# Altium schematic sheet Sheet2.SchDoc
size A3; SheetNumber: 1; SheetTotal: 1
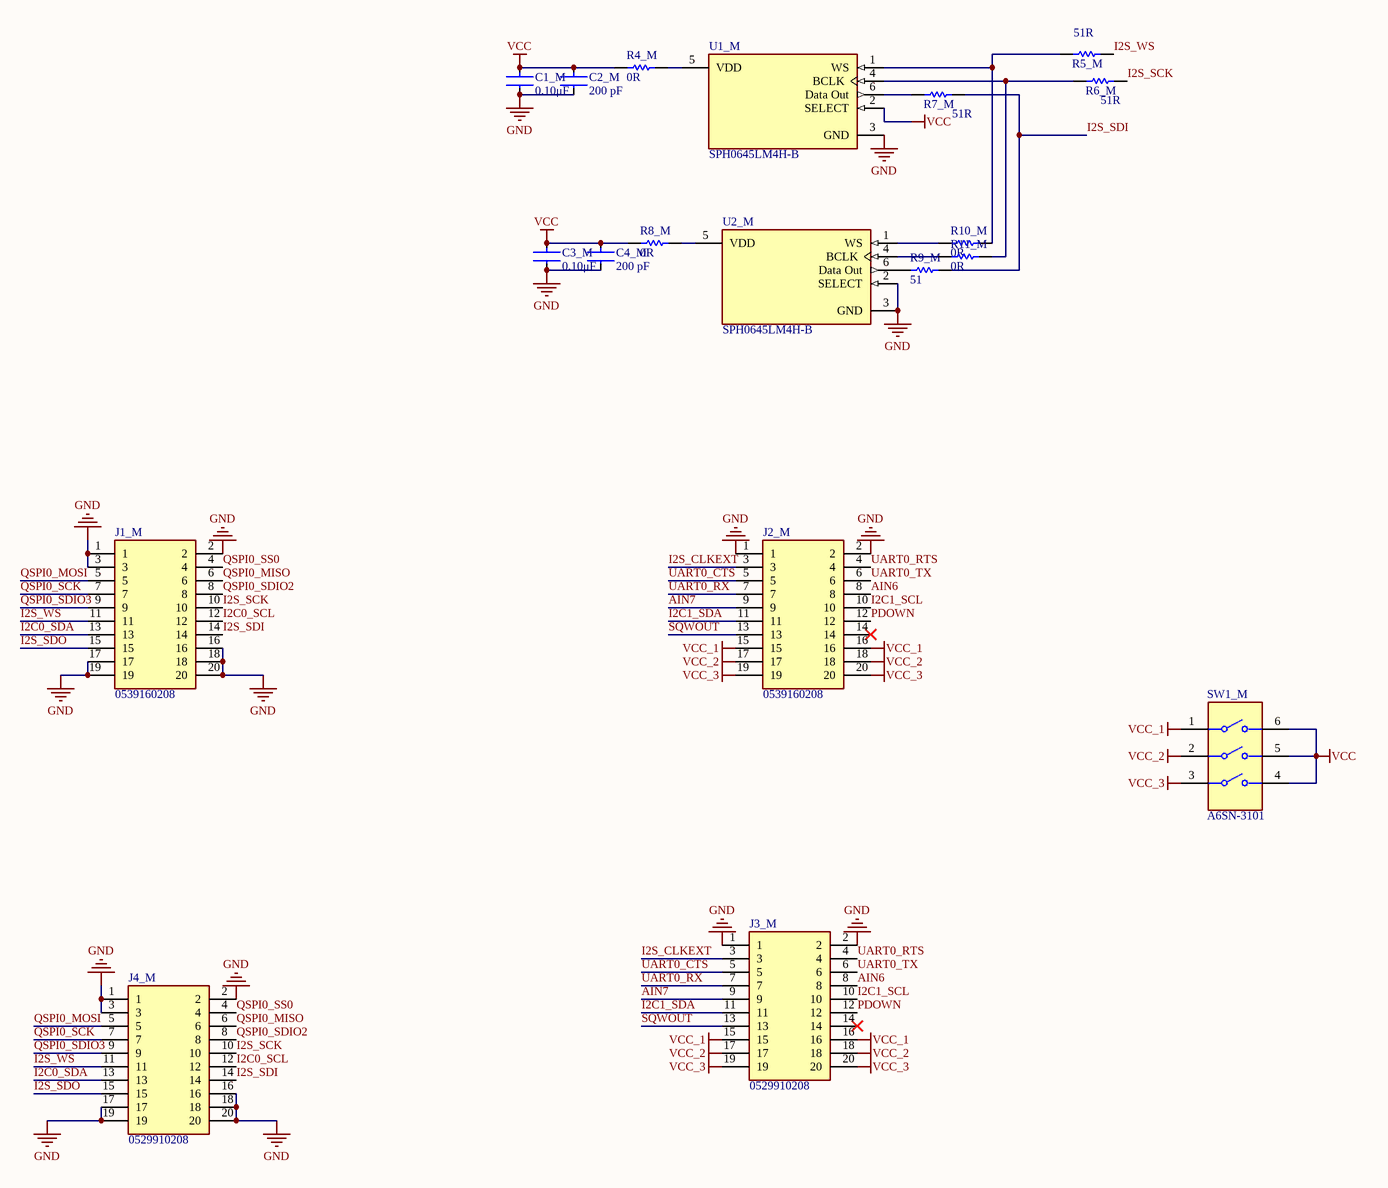
[diagram p0: Sheet2.SchDoc]

## Parts
C1_M  Capacitance: 0.10μF  [FP-GRM15-MFG]  (hidden comment: GRM155R71C104KA88D)
C2_M  Capacitance: 200 pF  [FP-C0402-BB-MFG]  (hidden comment: C0402C201J5GACTU)
C3_M  Capacitance: 0.10μF  [FP-GRM15-MFG]  (hidden comment: GRM155R71C104KA88D)
C4_M  Capacitance: 200 pF  [FP-C0402-BB-MFG]  (hidden comment: C0402C201J5GACTU)
J1_M  0539160208  [MOLEX-  539160208]
J2_M  0539160208  [MOLEX-  539160208]
J3_M  0529910208  [MOLEX_52991-0208]
J4_M  0529910208  [MOLEX_52991-0208]
R4_M  0R  [RESC1005X40X25NL05T10]
R5_M  51R  [RESC1005X40X25LL05T05]
R6_M  51R  [RESC1005X40X25LL05T05]
R7_M  51R  [RESC1005X40X25LL05T05]
R8_M  0R  [RESC1005X40X25NL05T10]
R9_M  51  [RESC1005X40X25LL05T05]
R10_M  0R  [RESC1005X40X25NL05T10]
R11_M  0R  [RESC1005X40X25NL05T10]
SW1_M  A6SN-3101  [FP-A6SN-3101-MFG]
U1_M  SPH0645LM4H-B  [FP-SPH0645LM4H-B-MFG]
U2_M  SPH0645LM4H-B  [FP-SPH0645LM4H-B-MFG]

## Nets
GND: C1_M.1 C2_M.2 C3_M.1 C4_M.2 J1_M.1 J1_M.2 J1_M.3 J1_M.16 J1_M.17 J1_M.18 J1_M.19 J1_M.20 J2_M.1 J2_M.2 J3_M.1 J3_M.2 J4_M.1 J4_M.2 J4_M.3 J4_M.16 J4_M.17 J4_M.18 J4_M.19 J4_M.20 U1_M.3(GND) U2_M.2(SELECT) U2_M.3(GND)
VCC: C1_M.2 C2_M.1 C3_M.2 C4_M.1 R4_M.1 R8_M.1 SW1_M.4 SW1_M.5 SW1_M.6 U1_M.2(SELECT)
VCC_1: J2_M.15 J2_M.16 J3_M.15 J3_M.16 SW1_M.1
VCC_2: J2_M.17 J2_M.18 J3_M.17 J3_M.18 SW1_M.2
VCC_3: J2_M.19 J2_M.20 J3_M.19 J3_M.20 SW1_M.3
AIN6: J2_M.8 J3_M.8
AIN7: J2_M.9 J3_M.9
I2C0_SCL: J1_M.12 J4_M.12
I2C0_SDA: J1_M.13 J4_M.13
I2C1_SCL: J2_M.10 J3_M.10
I2C1_SDA: J2_M.11 J3_M.11
I2S_CLKEXT: J2_M.3 J3_M.3
I2S_SCK: J1_M.10 J4_M.10 R6_M.2
I2S_SDI: J1_M.14 J4_M.14 R7_M.2 R9_M.2
I2S_SDO: J1_M.15 J4_M.15
I2S_WS: J1_M.11 J4_M.11 R5_M.2
PDOWN: J2_M.12 J3_M.12
QSPI0_MISO: J1_M.6 J4_M.6
QSPI0_MOSI: J1_M.5 J4_M.5
QSPI0_SCK: J1_M.7 J4_M.7
QSPI0_SDIO2: J1_M.8 J4_M.8
QSPI0_SDIO3: J1_M.9 J4_M.9
QSPI0_SS0: J1_M.4 J4_M.4
SQWOUT: J2_M.13 J3_M.13
UART0_CTS: J2_M.5 J3_M.5
UART0_RTS: J2_M.4 J3_M.4
UART0_RX: J2_M.7 J3_M.7
UART0_TX: J2_M.6 J3_M.6
NetR4_M_2: R4_M.2 U1_M.5(VDD)
NetR5_M_1: R5_M.1 R10_M.2 U1_M.1(WS)
NetR6_M_1: R6_M.1 R11_M.2 U1_M.4(BCLK)
NetR7_M_1: R7_M.1 U1_M.6(Data_Out)
NetR8_M_2: R8_M.2 U2_M.5(VDD)
NetR9_M_1: R9_M.1 U2_M.6(Data_Out)
NetR10_M_1: R10_M.1 U2_M.1(WS)
NetR11_M_1: R11_M.1 U2_M.4(BCLK)

Not connected (* = marked no-connect by the designer): J2_M 14*; J3_M 14*

## Library data of the parts
C1_M C3_M = CMP-2100-03641-2: CAP CER 0.1UF 16V X7R 0402; Manufacturer: Murata; Standoff Height: 0mm; Tolerance: 10%; Voltage Rating: 16Vdc; Material: Ceramic; Value: 0.10μF; RoHS: TRUE; Manufacturer Part Number: GRM155R71C104KA88D; Temperature Characteristic: X7R; Octopart: https://octopart.com/grm155r71c104ka88d-murata-196880; Digikey Description: CAP CER 0.1UF 16V X7R 0402; Device Class L3: Ceramic Capacitors; Height: 0.55mm; ComponentLink2Description: Datasheet; Temperature Range Low: -55°C; Ipc Land Pattern Name: CAPC10050X219; ComponentLink2URL: https://search.murata.co.jp/Ceramy/image/img/A01X/G101/ENG/GRM155R71H471KA01-01A.pdf; Device Class L1: Passive Components; Lead Free: yes; Category: Cap; Package: GRM15; Temperature: -55°C to +125°C; Device Class L2: Capacitors; Temperature Range High: +125°C; Mouser Description: 0402 0.1 uF 16V ±10 % Tolerance X7R SMT Multilayer Ceramic Capacitor
C2_M C4_M = CMP-1034-01347-3: CAP CER 200PF 50V NP0 0402; Manufacturer: Kemet; Temperature Coefficient: 15%; Temperature Characteristic: C0G; Material: Ceramic; Tolerance: 0.05; Lead Free: Yes; Temperature: -55°C to +125°C; Height: 0.55mm; ComponentLink2URL: https://content.kemet.com/datasheets/KEM_C1002_X7R_SMD.pdf; Temperature Range High: +125°C; RoHS: TRUE; Ipc Land Pattern Name: CAPC10050X50; Package: C0402-BB; Manufacturer Part Number: C0402C201J5GACTU; Digikey Description: CAP CER 200PF 50V NP0 0402; Octopart: https://octopart.com/c0402c201j5gactu-kemet-19049754; Category: Cap; Value: 200 pF; Automotive: No; ComponentLink2Description: Datasheet; Device Class L3: Ceramic Capacitors; Temperature Range Low: -55°C; Device Class L1: Passive Components; Voltage Rating: 50 V; Mouser Description: Cap Ceramic 200pF 50V C0G 5% SMD 0402 125°C Punched Paper T/R; Device Class L2: Capacitors
J1_M J2_M = 53916-0208
J3_M J4_M = 52991-0208: 20 Position Connector Receptacle, Center Strip Contacts Surface Mount Gold; MF: Molex; SnapEDA_Link: https://www.snapeda.com/parts/52991-0208/Molex/view-part/230631/?ref=snap; Availability: Unavailable; MP: 52991-0208; Price: None; Package: None; Value: *
R4_M R8_M R10_M R11_M = CMP-1011-00001-2: Manufacturer: Yageo / Phycomp; Part Number: RC0402JR-070RL
R5_M R6_M R7_M R9_M = CMP-2002-00977-1: Manufacturer: Panasonic; Part Number: ERJ-2RKF51R0X
SW1_M = CMP-08827-000007-1: SWITCH SLIDE DIP SPST 25MA 24V; Manufacturer: Omron Electronics Inc-EMC Div; Electromechanical Life: 1000Cycles; Contact Resistance: 200mΩ; Standoff Height: 0.7mm; Number Of Circuits: 3; Device Class L2: Switches; Device Class L3: DIP Switches; Ambient Temperature Range High: +85°C; RoHS: TRUE; Temperature Range High: +85°C; Ambient Temperature Range Low: -30°C; ComponentLink2URL: https://omronfs.omron.com/en_US/ecb/products/pdf/en-a6sn.pdf; Category: Switch; Temperature Range Low: -30°C; Digikey Description: SWITCH SLIDE DIP SPST 25MA 24V; Package: A6SN-3101; Mouser Description: DIP Switches / SIP Switches 3P Knife-Edge, 2.3mm Slide SMT Flat-Act; Device Class L1: Electromechanical; Current Rating: 25mA; Lead Free: Yes; ComponentLink2Description: Datasheet; Throw Configuration: SPST; Voltage Rating Dc: 24V; Height: 4.55mm; Octopart: https://octopart.com/a6sn-3101-omron-55396000; Automotive: No; Manufacturer Part Number: A6SN-3101; Temperature: -30°C to +85°C
U1_M U2_M = CMP-95043-000001-1: MICROPHONE MEMS DIGITAL I2S OMNI; Direction: Omnidirectional; Operating Supply Current: 600uA; Voltage Rating: 1.8V; Shape: Rectangular; Output Type: Digital; Length: 3.5mm; Packaging: Tape and Reel; Width: 2.65mm; Height: 1.08mm; Termination: Solder